# Altium schematic sheet Led_Ring.SchDoc: ZStation LED Ring
size A4; Engineer: Stephan Eersels; DocumentNumber: 12202925_ZS; Revision: 2.1; SheetNumber: 9; SheetTotal: 9